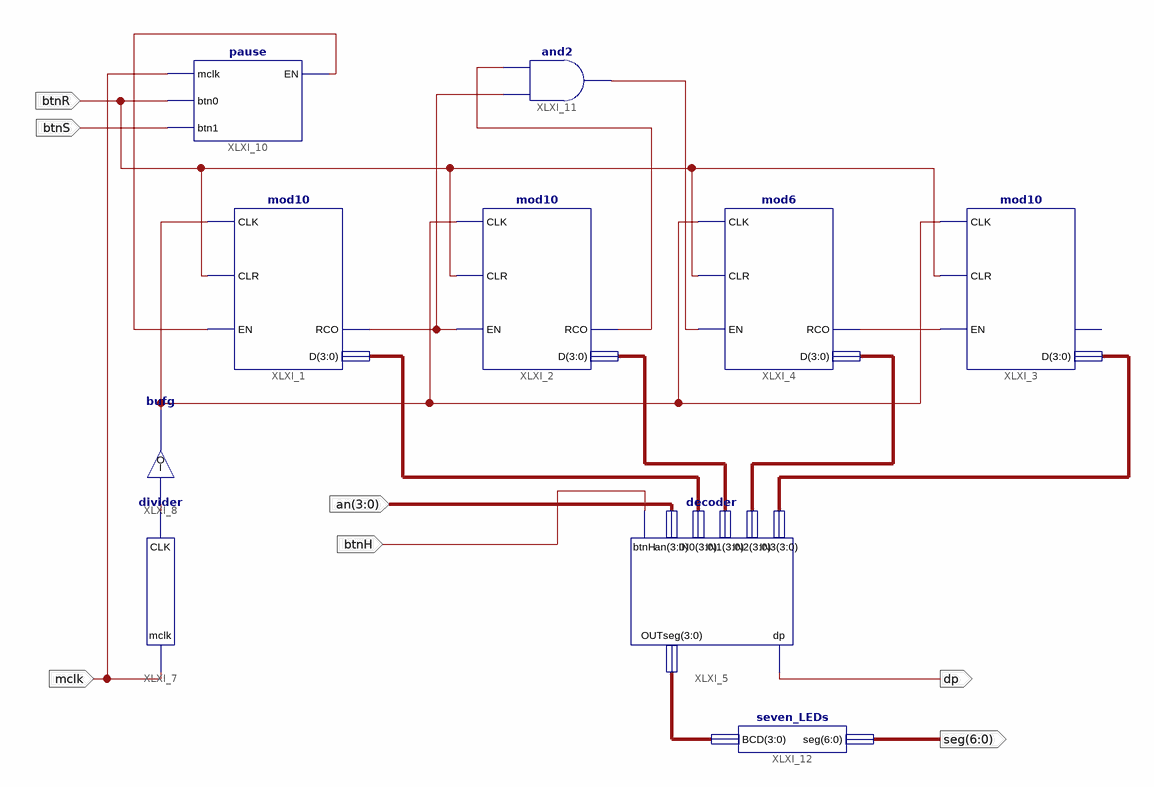
[diagram p0: schematic sheet 1]
// Xilinx ISE schematic stopwatch.sch (spartan3e) as structural Verilog: 10 symbols, 7 ports
module stopwatch (
  input  mclk,
  input  btnR,
  input  btnS,
  input  [3:0] an,
  input  btnH,
  output dp,
  output [6:0] seg
);

  wire XLXN_25, XLXN_29, XLXN_33, XLXN_39, XLXN_40, XLXN_49, XLXN_58;
  wire [3:0] XLXN_53, XLXN_54, XLXN_55, XLXN_56, XLXN_57;

  mod10 XLXI_1 (.CLK(XLXN_29), .CLR(btnR), .EN(XLXN_33), .RCO(XLXN_39), .D(XLXN_55));
  mod10 XLXI_2 (.CLK(XLXN_29), .CLR(btnR), .EN(XLXN_39), .RCO(XLXN_58), .D(XLXN_56));
  mod10 XLXI_3 (.CLK(XLXN_29), .CLR(btnR), .EN(XLXN_49), .D(XLXN_57));  // open: RCO
  mod6 XLXI_4 (.CLK(XLXN_29), .CLR(btnR), .EN(XLXN_40), .RCO(XLXN_49), .D(XLXN_54));
  decoder XLXI_5 (
    .btnH(btnH), .IN3(XLXN_57), .IN2(XLXN_54), .IN1(XLXN_56), .IN0(XLXN_55), .an(an), .dp(dp),
    .OUTseg(XLXN_53));
  divider XLXI_7 (.mclk(mclk), .CLK(XLXN_25));
  bufg XLXI_8 (.I(XLXN_25), .O(XLXN_29));
  pause XLXI_10 (.mclk(mclk), .btn0(btnR), .btn1(btnS), .EN(XLXN_33));
  and XLXI_11 (XLXN_40, XLXN_39, XLXN_58);
  seven_LEDs XLXI_12 (.BCD(XLXN_53), .seg(seg));
endmodule
